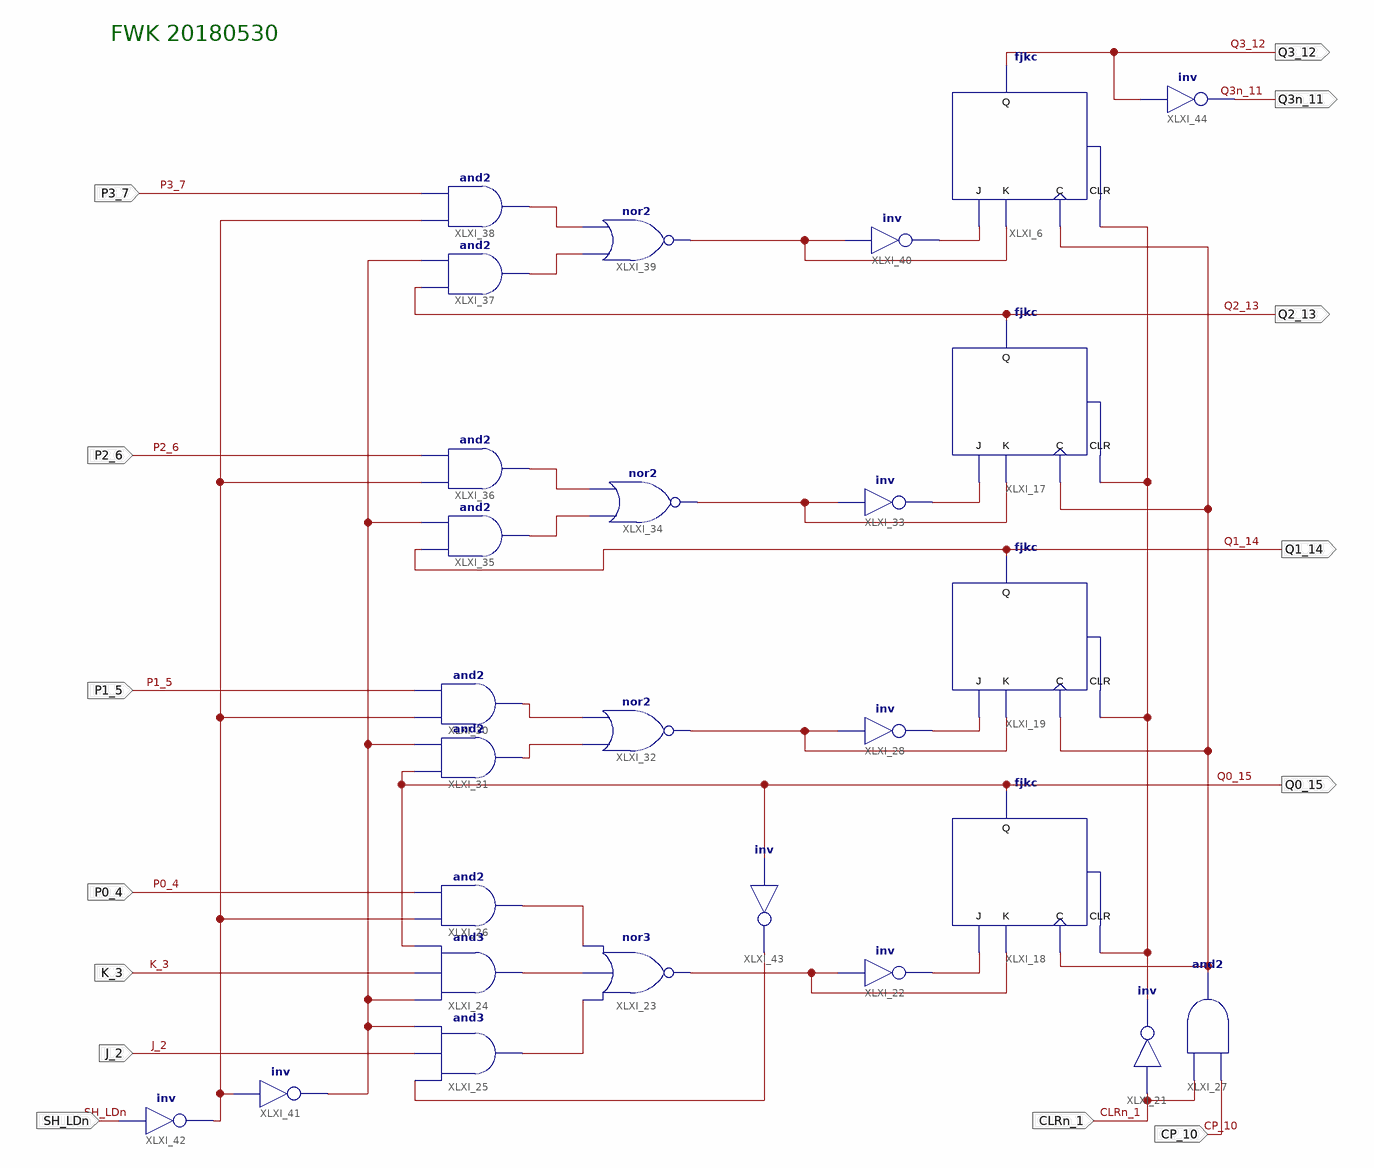
[diagram p0: schematic sheet 1]
// Xilinx ISE schematic chip74S195.sch (spartan3e) as structural Verilog: 27 symbols, 14 ports
module chip74S195 (
  input  CLRn_1,
  input  CP_10,
  input  SH_LDn,
  input  J_2,
  input  K_3,
  input  P0_4,
  input  P1_5,
  input  P2_6,
  input  P3_7,
  output Q0_15,
  output Q1_14,
  output Q2_13,
  output Q3_12,
  output Q3n_11
);

  wire XLXN_3, XLXN_9, XLXN_11, XLXN_12, XLXN_13, XLXN_17, XLXN_19, XLXN_20, XLXN_21, XLXN_22, XLXN_23,
       XLXN_24, XLXN_25, XLXN_26, XLXN_27, XLXN_28, XLXN_29, XLXN_30, XLXN_32, XLXN_37, XLXN_38, XLXN_49;

  fjkc XLXI_6 (.C(XLXN_17), .CLR(XLXN_3), .J(XLXN_27), .K(XLXN_28), .Q(Q3_12));
  fjkc XLXI_17 (.C(XLXN_17), .CLR(XLXN_3), .J(XLXN_23), .K(XLXN_24), .Q(Q2_13));
  fjkc XLXI_18 (.C(XLXN_17), .CLR(XLXN_3), .J(XLXN_9), .K(XLXN_38), .Q(Q0_15));
  fjkc XLXI_19 (.C(XLXN_17), .CLR(XLXN_3), .J(XLXN_19), .K(XLXN_20), .Q(Q1_14));
  not XLXI_21 (XLXN_3, CLRn_1);
  not XLXI_22 (XLXN_9, XLXN_38);
  nor XLXI_23 (XLXN_38, XLXN_13, XLXN_12, XLXN_11);
  and XLXI_24 (XLXN_12, XLXN_32, K_3, Q0_15);
  and XLXI_25 (XLXN_13, XLXN_37, J_2, XLXN_32);
  and XLXI_26 (XLXN_11, XLXN_49, P0_4);
  and XLXI_27 (XLXN_17, CP_10, CLRn_1);
  not XLXI_28 (XLXN_19, XLXN_20);
  and XLXI_30 (XLXN_22, XLXN_49, P1_5);
  and XLXI_31 (XLXN_21, Q0_15, XLXN_32);
  nor XLXI_32 (XLXN_20, XLXN_21, XLXN_22);
  not XLXI_33 (XLXN_23, XLXN_24);
  nor XLXI_34 (XLXN_24, XLXN_26, XLXN_25);
  and XLXI_35 (XLXN_26, Q1_14, XLXN_32);
  and XLXI_36 (XLXN_25, XLXN_49, P2_6);
  and XLXI_37 (XLXN_30, Q2_13, XLXN_32);
  and XLXI_38 (XLXN_29, XLXN_49, P3_7);
  nor XLXI_39 (XLXN_28, XLXN_30, XLXN_29);
  not XLXI_40 (XLXN_27, XLXN_28);
  not XLXI_41 (XLXN_32, XLXN_49);
  not XLXI_42 (XLXN_49, SH_LDn);
  not XLXI_43 (XLXN_37, Q0_15);
  not XLXI_44 (Q3n_11, Q3_12);

  // Notes on the sheet:
  //   FWK 20180530
endmodule
